# Altium schematic sheet TOPSHEET.SchDoc
size A; SheetNumber: 1; SheetTotal: 5
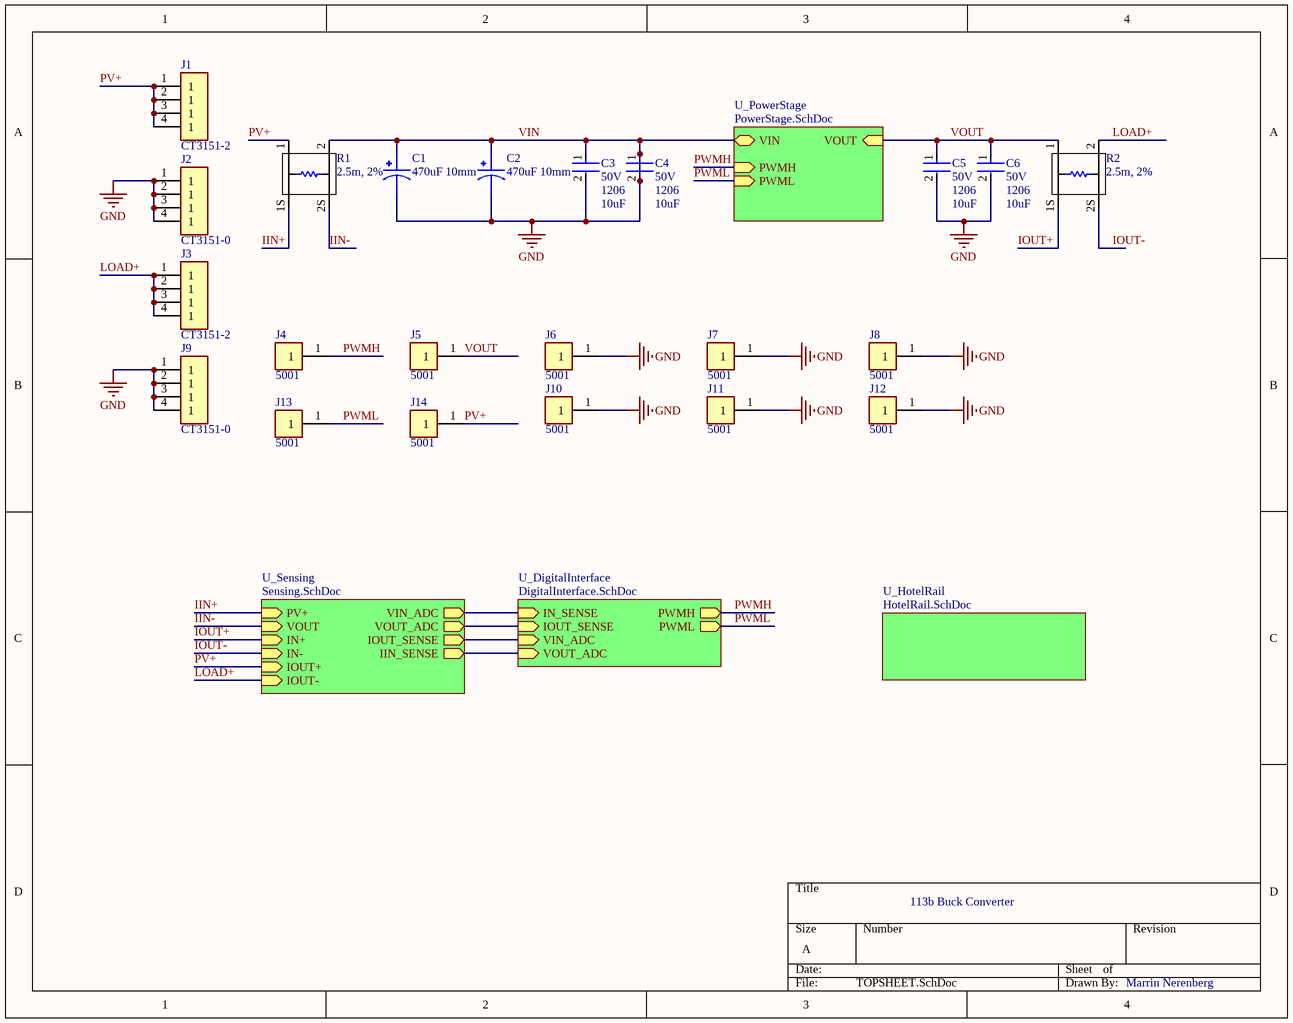
[diagram p0: TOPSHEET.SchDoc]

## Parts
C1  470uF 10mm  [CAPPRD500W60D1000H2200]
C2  470uF 10mm  [CAPPRD500W60D1000H2200]
C3  Voltage Rating (DC): 50V  Case/Package: 1206  Capacitance: 10uF  [FP-1206-L_3_2_0_2-W_1_6_0-IPC_B]  (hidden comment: 12065C475KAT2A)
C4  Voltage Rating (DC): 50V  Case/Package: 1206  Capacitance: 10uF  [FP-1206-L_3_2_0_2-W_1_6_0-IPC_B]  (hidden comment: 12065C475KAT2A)
C5  Voltage Rating (DC): 50V  Case/Package: 1206  Capacitance: 10uF  [FP-1206-L_3_2_0_2-W_1_6_0-IPC_B]  (hidden comment: 12065C475KAT2A)
C6  Voltage Rating (DC): 50V  Case/Package: 1206  Capacitance: 10uF  [FP-1206-L_3_2_0_2-W_1_6_0-IPC_B]  (hidden comment: 12065C475KAT2A)
J1  CT3151-2  [CALTEST_CT3151-2]
J2  CT3151-0  [CT3151-0]
J3  CT3151-2  [CALTEST_CT3151-2]
J4  5001  [FP-5001-MFG]
J5  5001  [FP-5001-MFG]
J6  5001  [FP-5001-MFG]
J7  5001  [FP-5001-MFG]
J8  5001  [FP-5001-MFG]
J9  CT3151-0  [CT3151-0]
J10  5001  [FP-5001-MFG]
J11  5001  [FP-5001-MFG]
J12  5001  [FP-5001-MFG]
J13  5001  [FP-5001-MFG]
J14  5001  [FP-5001-MFG]
R1  2.5m, 2%  [OHMITE_FC4L32]
R2  2.5m, 2%  [OHMITE_FC4L32]

## Sub-sheets
U_DigitalInterface = DigitalInterface.SchDoc: IN_SENSE (in), IOUT_SENSE (in), VIN_ADC (in), VOUT_ADC (in), PWMH (out), PWML (out)
U_HotelRail = HotelRail.SchDoc: no entries
U_PowerStage = PowerStage.SchDoc: VIN (bidir), PWMH (in), PWML (in), VOUT (in)
U_Sensing = Sensing.SchDoc: VIN_ADC (out), PV+ (in), VOUT (in), VOUT_ADC (out), IOUT_SENSE (out), IIN_SENSE (out), IN+ (in), IN- (in), IOUT+ (in), IOUT- (in)

## Nets
VIN: C1.1 C1.2 C2.1 C2.2 C3.1 C3.2 C4.1 C4.2 C5.2 C6.2 J2.1 J2.2(1) J2.3(1) J2.4(1) J6.1 J7.1 J8.1 J9.1 J9.2(1) J9.3(1) J9.4(1) J10.1 J11.1 J12.1 R1.2 ; sheet U_PowerStage/VIN  [also labelled GND]
IIN+: R1.1S ; sheet U_Sensing/PV+
IIN-: R1.2S ; sheet U_Sensing/VOUT
IOUT+: R2.1S ; sheet U_Sensing/IN+
IOUT-: R2.2S ; sheet U_Sensing/IN-
LOAD+: J3.1 J3.2(1) J3.3(1) J3.4(1) R2.2 ; sheet U_Sensing/IOUT-
PV+: J1.1 J1.2(1) J1.3(1) J1.4(1) J14.1 R1.1 ; sheet U_Sensing/IOUT+
PWMH: J4.1 ; sheet U_DigitalInterface/PWMH, sheet U_PowerStage/PWMH
PWML: J13.1 ; sheet U_DigitalInterface/PWML, sheet U_PowerStage/PWML
VOUT: C5.1 C6.1 J5.1 R2.1 ; sheet U_PowerStage/VOUT
(unnamed): sheet U_DigitalInterface/IN_SENSE, sheet U_Sensing/VIN_ADC
(unnamed): sheet U_DigitalInterface/IOUT_SENSE, sheet U_Sensing/VOUT_ADC
(unnamed): sheet U_DigitalInterface/VIN_ADC, sheet U_Sensing/IOUT_SENSE
(unnamed): sheet U_DigitalInterface/VOUT_ADC, sheet U_Sensing/IIN_SENSE

## Notes on the sheet
- 113b Buck Converter
- Marrin Nerenberg

## Library data of the parts
C1 C2 = B41856C7477M000: MF: {'manufacturer': u'EPCOS'}; Package: None; Price: None; Value: *; MP: B41856C7477M000; Availability: Unavailable
C3-C6 = CMP-2000-07581-3: CAP CER 4.7UF 50V X7R 1206; Manufacturer: Kyocera AVX; Dissipation Factor: 2.5%; Tolerance: 10%; Mount: Surface Mount; Width: 1.6mm; Voltage Rating: 50V; Case Code (Imperial): 1206; Packaging: Tape and Reel; Min Operating Temperature: -55°C; Contact Plating: Tin; Radiation Hardening: No; Depth: 1.6mm; Series: -; Construction: Flat; Dielectric: X7R; Length: 3.2mm; Max Operating Temperature: 125°C; RoHS Compliant: Yes; Lead Free: Lead Free; Package Quantity: 1; Case Code (Metric): 3216; Termination: SMD/SMT; REACH SVHC: No SVHC; Thickness: 0.07inch; Manufacturer Part Number: 12065C475KAT2A
J1 J3 = CT3151-2_1: Banana Jack Connector Standard Banana Solder Red; MF: {'manufacturer': u'Cal Test'}; Package: None; Price: None; Value: *; MP: CT3151-2; Availability: Unavailable
J2 J9 = CT3151-2: Banana Jack Connector Standard Banana Solder Red; MF: {'manufacturer': u'Cal Test'}; Package: None; Price: None; Value: *; MP: CT3151-2; Availability: Unavailable
J4-J8 J10-J14 = CMP-2000-05181-2: PC TEST POINT MINIATURE BLACK; Manufacturer: Keystone Electronics; Body Material: Bronze; Plating: Silver; Inside Diameter: 1.27mm; Hole Diameter: 1.6mm; Number of Ports: 1; Outside Diameter: 2.54mm; Insulation: Insulated; Insulation Material: Nylon; Mount: Through Hole; RoHS Compliant: Yes; Series: THM; Height: 0.3inch; Termination: Through Hole; Material: Nylon; Packaging: Bulk; Contact Material: Bronze; REACH SVHC: No SVHC; Contact Plating: Silver; Orientation: Straight; Lead Free: Lead Free; Package Quantity: 100; Length: 7.62mm; Flammability Rating: UL94 V-0; Number of Contacts: 1; Diameter: 2.54mm; Housing Color: Black; Color: Black; Manufacturer Part Number: 5001
R1 R2 = FC4L32R002GER: 2m, 0612, 2%, 1W; ID: 79; Mfg: Ohmite; Voltage: 0.045V; Current: 45A; TempOperatingMax: 155; TempOperatingMin: -55; MfgPN: FC4L32R002GER; Value: 2.5m; Tolerance: 2%; Power: 1W; RoHS: True; SMD: True; Material: Metal Foil; Footprint: 0612; Supplier 1: Digi-Key; Supplier Part Number 1: FC4L32R002GER-ND